# EAGLE design FIO_F (EAGLE 9.5.2)
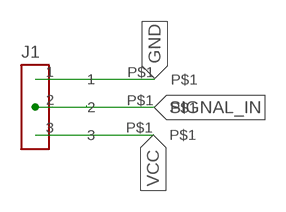
[diagram p0: schematic, sheet 1]

## Parts
J1  CONECTOR_FEMEA  [3CONECTOR]
U$1  PAD  [PAD]
U$2  PAD  [PAD]
VCC  PAD  [PAD]

## Nets
GND: J1.1 U$1.P$1
SIGNAL_IN: J1.2 U$2.P$1
VCC: J1.3 VCC.P$1

## Library data of the parts
J1 = Eletroblocks Lib:CONECTOR_FEMEA
U$1 U$2 VCC = Eletroblocks Lib:PAD

## Board
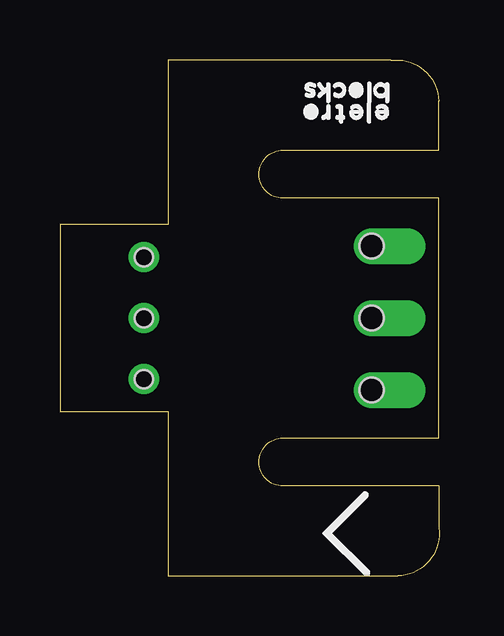
[diagram p1: board, top side]
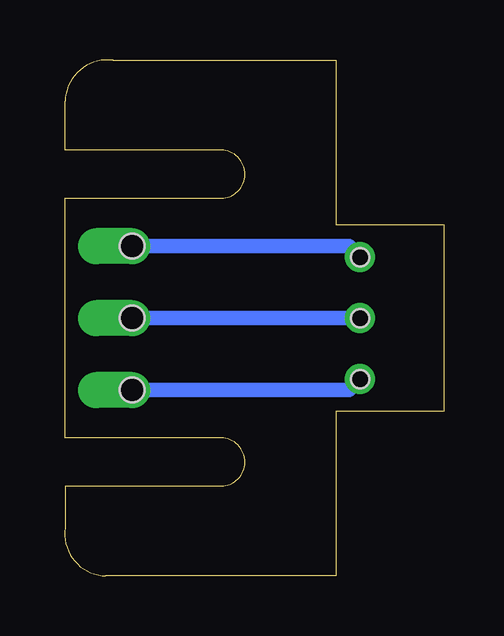
[diagram p2: board, bottom side, seen from below]

Size 15.81 x 21.51 mm. Coordinates in mm from the lower left corner, seen from the top.
Outline: 4.5,0 14.1,0 arc96 15.8,2 15.8,3.75 9.3,3.75 arc-180 9.3,5.75 15.8,5.75 15.8,15.75 9.3,15.75 arc-180 9.3,17.75 15.8,17.75 15.8,19.8 arc96 13.8,21.5 4.5,21.5 4.5,14.65 0,14.65 0,6.85 4.5,6.85 4.5,0
Copper layers (1*16): Top 0.035mm / dielectric 1.5mm / Bottom 0.035mm
Design rules "default": minimum track width 6mil, minimum drill 0.35mm, track to track 6mil, track to pad 6mil, pad to pad 6mil, via to via 6mil, smd to smd 6mil, copper to edge 40mil, drill to drill 6mil, minimum pad ring 10mil, minimum via ring 8mil, stop-mask expansion 4mil, vias tented up to drill 0mil, thermal gap 10mil

### Footprints (pad centres in the part's own frame; a part is rotated, then mirrored left to right if it is on the bottom)
3CONECTOR = drill 0.75: 1 0,2.54; 2 0,0; 3 0,-2.54 | hole 0.75: 0,2.54; 0,0; 0,-2.54
PAD = drill 1 offset: P$1 0,0 | hole 1.016: 0,0

### Placement (x,y rotation side)
J1  3.5,10.75 0 top
U$1  13,13.75 0 top
U$2  13,10.75 0 top
VCC  13,7.75 0 top

### Tracks (layer width: path | path; a pad name or v marks a point on that pad's centre or on a via)
GND
  Bottom 0.61: U$1.P$1 3.96,13.75 J1.1
SIGNAL_IN
  Bottom 0.61: U$2.P$1 J1.2
VCC
  Bottom 0.61: VCC.P$1 3.96,7.75 J1.3